# Altium schematic sheet Sheet1.SchDoc
size A4
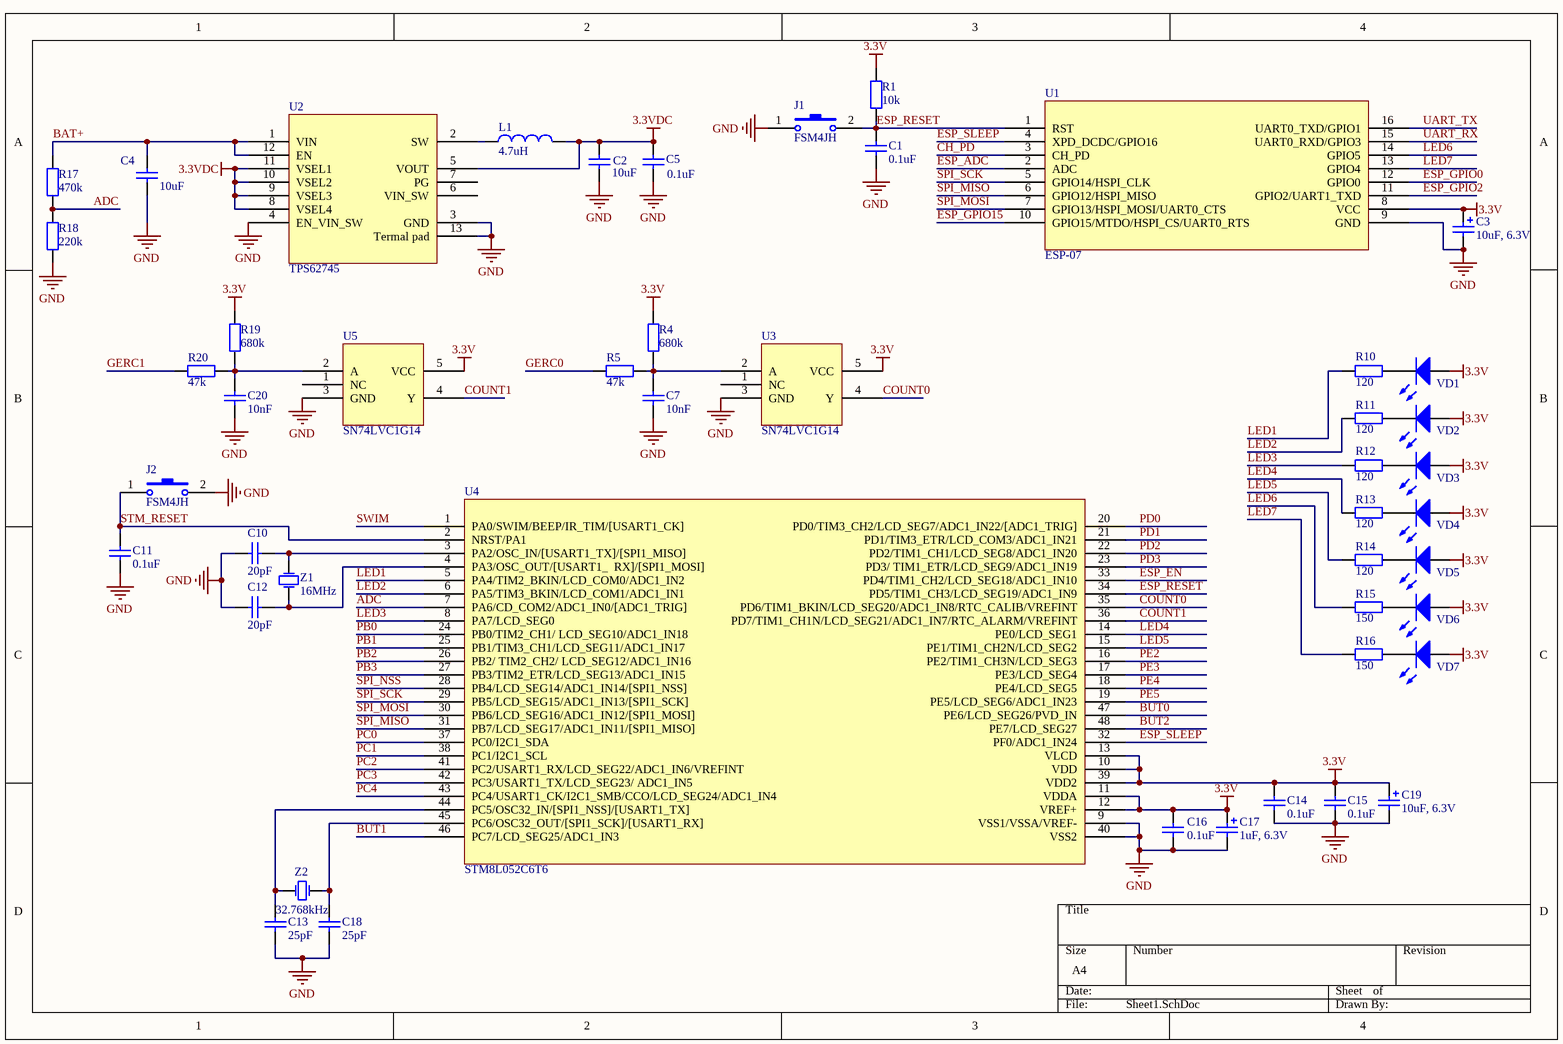
[diagram p0: Sheet1.SchDoc]

## Parts
C1  value 0.1uF  [0603(CAPC1608X09N)]  (hidden comment: Capacitor)
C2  value 10uF  [1206(CAPC3216X15N)]  (hidden comment: Capacitor)
C3  value 10uF, 6.3V  [1206(typeA)]  (hidden comment: Capacitor Polarized)
C4  value 10uF  [1206(CAPC3216X15N)]  (hidden comment: Capacitor)
C5  value 0.1uF  [0603(CAPC1608X09N)]  (hidden comment: Capacitor)
C7  value 10nF  [0603(CAPC1608X09N)]  (hidden comment: Capacitor)
C10  value 20pF  [0603(CAPC1608X09N)]  (hidden comment: Capacitor)
C11  value 0.1uF  [0603(CAPC1608X09N)]  (hidden comment: Capacitor)
C12  value 20pF  [0603(CAPC1608X09N)]  (hidden comment: Capacitor)
C13  value 25pF  [0603(CAPC1608X09N)]  (hidden comment: Capacitor)
C14  value 0.1uF  [0603(CAPC1608X09N)]  (hidden comment: Capacitor)
C15  value 0.1uF  [0603(CAPC1608X09N)]  (hidden comment: Capacitor)
C16  value 0.1uF  [0603(CAPC1608X09N)]  (hidden comment: Capacitor)
C17  value 1uF, 6.3V  [1206(typeA)]  (hidden comment: Capacitor Polarized)
C18  value 25pF  [0603(CAPC1608X09N)]  (hidden comment: Capacitor)
C19  value 10uF, 6.3V  [1206(typeA)]  (hidden comment: Capacitor Polarized)
C20  value 10nF  [0603(CAPC1608X09N)]  (hidden comment: Capacitor)
J1  FSM4JH  [FSM4JH]
J2  FSM4JH  [FSM4JH]
L1  value 4.7uH  [0806 (2016)]  (hidden comment: Inductor)
R1  value 10k  [0603(RESC1608X05N)]  (hidden comment: Resistor)
R4  value 680k  [0603(RESC1608X05N)]  (hidden comment: Resistor)
R5  value 47k  [0603(RESC1608X05N)]  (hidden comment: Resistor)
R10  value 120  [0603(RESC1608X05N)]  (hidden comment: Resistor)
R11  value 120  [0603(RESC1608X05N)]  (hidden comment: Resistor)
R12  value 120  [0603(RESC1608X05N)]  (hidden comment: Resistor)
R13  value 120  [0603(RESC1608X05N)]  (hidden comment: Resistor)
R14  value 120  [0603(RESC1608X05N)]  (hidden comment: Resistor)
R15  value 150  [0603(RESC1608X05N)]  (hidden comment: Resistor)
R16  value 150  [0603(RESC1608X05N)]  (hidden comment: Resistor)
R17  value 470k  [0603(RESC1608X05N)]  (hidden comment: Resistor)
R18  value 220k  [0603(RESC1608X05N)]  (hidden comment: Resistor)
R19  value 680k  [0603(RESC1608X05N)]  (hidden comment: Resistor)
R20  value 47k  [0603(RESC1608X05N)]  (hidden comment: Resistor)
U1  ESP-07  [ESP-07]
U2  TPS62745  [12-WSON (3x2)]
U3  SN74LVC1G14  [SOT23-5]
U4  STM8L052C6T6  [LQFP-48]
U5  SN74LVC1G14  [SOT23-5]
VD1  Led  [GNL-3014xx]  (value not drawn)
VD2  Led  [GNL-3014xx]  (value not drawn)
VD3  Led  [GNL-3014xx]  (value not drawn)
VD4  Led  [GNL-3014xx]  (value not drawn)
VD5  Led  [GNL-3014xx]  (value not drawn)
VD6  Led  [GNL-3014xx]  (value not drawn)
VD7  Led  [GNL-3014xx]  (value not drawn)
Z1  value 16MHz  [HC49S]  (hidden comment: Crystal Oscillator)
Z2  value 32.768kHz  [KX–327NHT]  (hidden comment: Crystal Oscillator)

## Nets
3.3V: C3.1 C14.2 C15.2 C16.1 C17.1 C19.1 R1.2 R4.2 R19.2 U1.8(VCC) U3.5(VCC) U4.10(VDD) U4.11(VDDA) U4.12(VREF+) U4.13(VLCD) U4.39(VDD2) U5.5(VCC) VD1.1(A) VD2.1(A) VD3.1(A) VD4.1(A) VD5.1(A) VD6.1(A) VD7.1(A)
3.3VDC: C2.2 C5.2 L1.1 U2.5(VOUT) U2.8(VSEL4) U2.9(VSEL3) U2.10(VSEL2) U2.11(VSEL1)
GND: C1.1 C2.1 C3.2 C4.2 C5.1 C7.1 C10.1 C11.1 C12.1 C13.1 C14.1 C15.1 C16.2 C17.2 C18.1 C19.2 C20.1 J1.1(COMMON1) J2.2(NO1) R18.1 U1.9(GND) U2.3(GND) U2.4(EN_VIN_SW) U2.13(Termal_pad) U3.3(GND) U4.9(VSS1/VSSA/VREF-) U4.40(VSS2) U5.3(GND)
ADC: R17.1 R18.2 U4.7(PA6/CD_COM2/ADC1_IN0/[ADC1_TRIG])
BAT+: C4.1 R17.2 U2.1(VIN) U2.12(EN)
BUT0: U4.47(PE6/LCD_SEG26/PVD_IN)
BUT1: U4.46(PC7/LCD_SEG25/ADC1_IN3)
BUT2: U4.48(PE7/LCD_SEG27)
CH_PD: U1.3(CH_PD)
COUNT0: U3.4(Y) U4.35(PD6/TIM1_BKIN/LCD_SEG20/ADC1_IN8/RTC_CALIB/VREFINT)
COUNT1: U4.36(PD7/TIM1_CH1N/LCD_SEG21/ADC1_IN7/RTC_ALARM/VREFINT) U5.4(Y)
ESP_ADC: U1.2(ADC)
ESP_EN: U4.33(PD4/TIM1_CH2/LCD_SEG18/ADC1_IN10)
ESP_GPIO0: U1.12(GPIO0)
ESP_GPIO2: U1.11(GPIO2/UART1_TXD)
ESP_GPIO15: U1.10(GPIO15/MTDO/HSPI_CS/UART0_RTS)
ESP_RESET: C1.2 J1.2(NO1) R1.1 U1.1(RST) U4.34(PD5/TIM1_CH3/LCD_SEG19/ADC1_IN9)
ESP_SLEEP: U1.4(XPD_DCDC/GPIO16) U4.32(PF0/ADC1_IN24)
GERC0: R5.2
GERC1: R20.2
LED1: R10.1 U4.5(PA4/TIM2_BKIN/LCD_COM0/ADC1_IN2)
LED2: R11.1 U4.6(PA5/TIM3_BKIN/LCD_COM1/ADC1_IN1)
LED3: R12.1 U4.8(PA7/LCD_SEG0)
LED4: R13.1 U4.14(PE0/LCD_SEG1)
LED5: R14.1 U4.15(PE1/TIM1_CH2N/LCD_SEG2)
LED6: R15.1 U1.14(GPIO5)
LED7: R16.1 U1.13(GPIO4)
PB0: U4.24(PB0/TIM2_CH1/_LCD_SEG10/ADC1_IN18)
PB1: U4.25(PB1/TIM3_CH1/LCD_SEG11/ADC1_IN17)
PB2: U4.26(PB2/_TIM2_CH2/_LCD_SEG12/ADC1_IN16)
PB3: U4.27(PB3/TIM2_ETR/LCD_SEG13/ADC1_IN15)
PC0: U4.37(PC0/I2C1_SDA)
PC1: U4.38(PC1/I2C1_SCL)
PC2: U4.41(PC2/USART1_RX/LCD_SEG22/ADC1_IN6/VREFINT)
PC3: U4.42(PC3/USART1_TX/LCD_SEG23/_ADC1_IN5)
PC4: U4.43(PC4/USART1_CK/I2C1_SMB/CCO/LCD_SEG24/ADC1_IN4)
PD0: U4.20(PD0/TIM3_CH2/LCD_SEG7/ADC1_IN22/[ADC1_TRIG])
PD1: U4.21(PD1/TIM3_ETR/LCD_COM3/ADC1_IN21)
PD2: U4.22(PD2/TIM1_CH1/LCD_SEG8/ADC1_IN20)
PD3: U4.23(PD3/_TIM1_ETR/LCD_SEG9/ADC1_IN19)
PE2: U4.16(PE2/TIM1_CH3N/LCD_SEG3)
PE3: U4.17(PE3/LCD_SEG4)
PE4: U4.18(PE4/LCD_SEG5)
PE5: U4.19(PE5/LCD_SEG6/ADC1_IN23)
SPI_MISO: U1.6(GPIO12/HSPI_MISO) U4.31(PB7/LCD_SEG17/ADC1_IN11/[SPI1_MISO])
SPI_MOSI: U1.7(GPIO13/HSPI_MOSI/UART0_CTS) U4.30(PB6/LCD_SEG16/ADC1_IN12/[SPI1_MOSI])
SPI_NSS: U4.28(PB4/LCD_SEG14/ADC1_IN14/[SPI1_NSS])
SPI_SCK: U1.5(GPIO14/HSPI_CLK) U4.29(PB5/LCD_SEG15/ADC1_IN13/[SPI1_SCK])
STM_RESET: C11.2 J2.1(COMMON1) U4.2(NRST/PA1)
SWIM: U4.1(PA0/SWIM/BEEP/IR_TIM/[USART1_CK])
UART_RX: U1.15(UART0_RXD/GPIO3)
UART_TX: U1.16(UART0_TXD/GPIO1)
NetC7_2: C7.2 R4.1 R5.1 U3.2(A)
NetC10_2: C10.2 U4.3(PA2/OSC_IN/[USART1_TX]/[SPI1_MISO]) Z1.2(OSC2)
NetC12_2: C12.2 U4.4(PA3/OSC_OUT/[USART1___RX]/[SPI1_MOSI]) Z1.1(OSC1)
NetC13_2: C13.2 U4.44(PC5/OSC32_IN/[SPI1_NSS]/[USART1_TX]) Z2.2(OSC2)
NetC18_2: C18.2 U4.45(PC6/OSC32_OUT/[SPI1_SCK]/[USART1_RX]) Z2.1(OSC1)
NetC20_2: C20.2 R19.1 R20.1 U5.2(A)
NetL1_2: L1.2 U2.2(SW)
NetR10_2: R10.2 VD1.2(K)
NetR11_2: R11.2 VD2.2(K)
NetR12_2: R12.2 VD3.2(K)
NetR13_2: R13.2 VD4.2(K)
NetR14_2: R14.2 VD5.2(K)
NetR15_2: R15.2 VD6.2(K)
NetR16_2: R16.2 VD7.2(K)

Not connected (* = marked no-connect by the designer): U2 6(VIN_SW) 7(PG); U3 1(NC); U5 1(NC)

## Library data of the parts
C1 C2 C4 C5 C7 C10-C16 C18 C20 = Capacitor: Name: Конденсатор керамический SMD
C3 C17 C19 = Polarized Capacitor: Name: Конденсатор электролитический танталовый SMD
J1 J2 = Tact switch: Model: FSM4JH
L1 = Inductor: Name: Индуктивность SMD; Model: DFE201612E
R1 R4 R5 R10-R20 = Resistor: Name: Резистор SMD
U1 = ESP-07: WiFi module; Model: ESP-07
U2 = TPS62745: DC/DC step down; Part number: TPS62745DSST; Manufacturer: Texas Instruments; Datasheet: http://www.ti.com/lit/ds/symlink/tps62745.pdf; Model: TPS62745; Package: 12-WSON (3x2)
U3 U5 = SN74LVC1G14: Single SchmittT-Trigger Inverter; Part number: SN74LVC1G14DBVR; Manufacturer: Texas Instruments; Package: SOT-23-5; Datasheet: http://www.ti.com/lit/ds/symlink/sn74lvc1g14.pdf; Model: SN74LVC1G14
U4 = STM8L052C6: MCU; Manufacturer: STMicroelectronics; Model: STM8L052C6T6; Part number: STM8L052C6T6; Datasheet: https://www.st.com/content/ccc/resource/technical/document/datasheet/05/b6/38/25/7d/c5/4b/cd/DM00057687.pdf/files/DM00057687.pdf/jcr:content/translations/en.DM00057687.pdf; Package: 48-LQFP (7x7)
VD1-VD7 = Led: Светодиод; Name: Светодиод 1206 зеленый
Z1 Z2 = Crystal: Name: Кварцевый резонатор